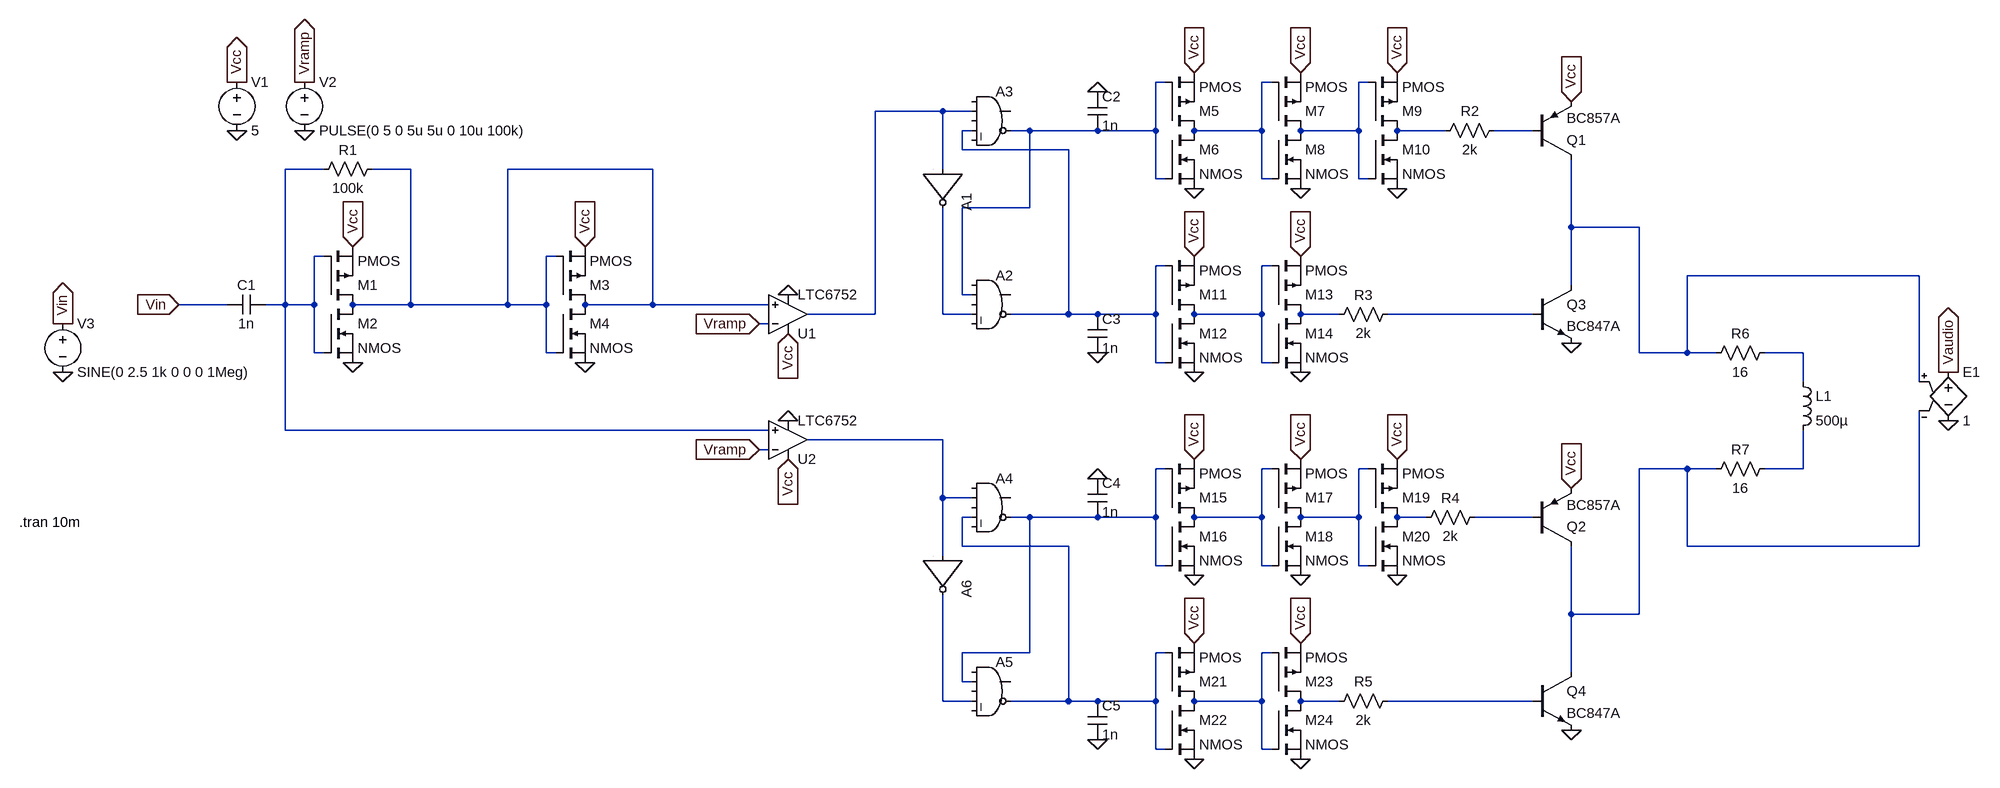
[diagram p0: schematic Week_4&5.asc]
Week_4&5.asc, the LTspice schematic file:
Version 4
SHEET 1 2884 900
WIRE 1488 -256 1472 -256
WIRE 1664 -256 1648 -256
WIRE 1824 -256 1808 -256
WIRE 1120 -208 1008 -208
WIRE 1168 -208 1120 -208
WIRE 1168 -176 1152 -176
WIRE 1264 -176 1232 -176
WIRE 1376 -176 1264 -176
WIRE 1472 -176 1472 -256
WIRE 1472 -176 1376 -176
WIRE 1648 -176 1648 -256
WIRE 1648 -176 1536 -176
WIRE 1808 -176 1808 -256
WIRE 1808 -176 1712 -176
WIRE 1952 -176 1872 -176
WIRE 2096 -176 2032 -176
WIRE 1152 -144 1152 -176
WIRE 1328 -144 1152 -144
WIRE 96 -112 32 -112
WIRE 240 -112 176 -112
WIRE 640 -112 400 -112
WIRE 1120 -112 1120 -208
WIRE 1472 -96 1472 -176
WIRE 1488 -96 1472 -96
WIRE 1648 -96 1648 -176
WIRE 1664 -96 1648 -96
WIRE 1808 -96 1808 -176
WIRE 1824 -96 1808 -96
WIRE 1264 -48 1264 -176
WIRE 1264 -48 1152 -48
WIRE 2160 -16 2160 -128
WIRE 2272 -16 2160 -16
WIRE 96 32 80 32
WIRE 480 32 464 32
WIRE 1488 48 1472 48
WIRE 1664 48 1648 48
WIRE 2736 64 2352 64
WIRE 2160 80 2160 -16
WIRE 1152 96 1152 -48
WIRE 1168 96 1152 96
WIRE -64 112 -144 112
WIRE 32 112 32 -112
WIRE 32 112 0 112
WIRE 80 112 80 32
WIRE 80 112 32 112
WIRE 240 112 240 -112
WIRE 240 112 144 112
WIRE 400 112 400 -112
WIRE 400 112 240 112
WIRE 464 112 464 32
WIRE 464 112 400 112
WIRE 640 112 640 -112
WIRE 640 112 528 112
WIRE 832 112 640 112
WIRE 1008 128 1008 -208
WIRE 1008 128 896 128
WIRE 1120 128 1120 -48
WIRE 1168 128 1120 128
WIRE 1328 128 1328 -144
WIRE 1328 128 1232 128
WIRE 1376 128 1328 128
WIRE 1472 128 1472 48
WIRE 1472 128 1376 128
WIRE 1648 128 1648 48
WIRE 1648 128 1536 128
WIRE 1776 128 1712 128
WIRE 2096 128 1856 128
WIRE 832 144 816 144
WIRE 80 192 80 112
WIRE 96 192 80 192
WIRE 464 192 464 112
WIRE 480 192 464 192
WIRE 2272 192 2272 -16
WIRE 2352 192 2352 64
WIRE 2352 192 2272 192
WIRE 2400 192 2352 192
WIRE 2544 192 2480 192
WIRE 1472 208 1472 128
WIRE 1488 208 1472 208
WIRE 1648 208 1648 128
WIRE 1664 208 1648 208
WIRE 2544 240 2544 192
WIRE 2736 240 2736 64
WIRE 32 320 32 112
WIRE 832 320 32 320
WIRE 1120 336 896 336
WIRE 832 352 816 352
WIRE 1488 384 1472 384
WIRE 1664 384 1648 384
WIRE 1824 384 1808 384
WIRE 2352 384 2272 384
WIRE 2400 384 2352 384
WIRE 2544 384 2544 320
WIRE 2544 384 2480 384
WIRE 1120 432 1120 336
WIRE 1168 432 1120 432
WIRE 1168 464 1152 464
WIRE 1264 464 1232 464
WIRE 1376 464 1264 464
WIRE 1472 464 1472 384
WIRE 1472 464 1376 464
WIRE 1648 464 1648 384
WIRE 1648 464 1536 464
WIRE 1808 464 1808 384
WIRE 1808 464 1712 464
WIRE 1920 464 1872 464
WIRE 2096 464 2000 464
WIRE 1152 512 1152 464
WIRE 1328 512 1152 512
WIRE 2352 512 2352 384
WIRE 2736 512 2736 288
WIRE 2736 512 2352 512
WIRE 1120 528 1120 432
WIRE 1472 544 1472 464
WIRE 1488 544 1472 544
WIRE 1648 544 1648 464
WIRE 1664 544 1648 544
WIRE 1808 544 1808 464
WIRE 1824 544 1808 544
WIRE 2160 624 2160 512
WIRE 2272 624 2272 384
WIRE 2272 624 2160 624
WIRE 1264 688 1264 464
WIRE 1264 688 1152 688
WIRE 1488 688 1472 688
WIRE 1664 688 1648 688
WIRE 2160 720 2160 624
WIRE 1152 736 1152 688
WIRE 1168 736 1152 736
WIRE 1120 768 1120 592
WIRE 1168 768 1120 768
WIRE 1328 768 1328 512
WIRE 1328 768 1232 768
WIRE 1376 768 1328 768
WIRE 1472 768 1472 688
WIRE 1472 768 1376 768
WIRE 1648 768 1648 688
WIRE 1648 768 1536 768
WIRE 1776 768 1712 768
WIRE 2096 768 1856 768
WIRE 1472 848 1472 768
WIRE 1488 848 1472 848
WIRE 1648 848 1648 768
WIRE 1664 848 1648 848
FLAG -48 -176 0
FLAG -48 -256 Vcc
IOPIN -48 -256 Out
FLAG 144 16 Vcc
IOPIN 144 16 In
FLAG 144 208 0
FLAG 528 16 Vcc
IOPIN 528 16 In
FLAG 528 208 0
FLAG -144 112 Vin
IOPIN -144 112 In
FLAG 864 160 Vcc
IOPIN 864 160 In
FLAG 864 368 Vcc
IOPIN 864 368 In
FLAG 864 96 0
FLAG 864 304 0
FLAG 64 -176 0
FLAG 64 -256 Vramp
IOPIN 64 -256 Out
FLAG 816 144 Vramp
IOPIN 816 144 In
FLAG 816 352 Vramp
IOPIN 816 352 In
FLAG -336 224 0
FLAG -336 144 Vin
IOPIN -336 144 Out
FLAG 1376 832 0
FLAG 1376 400 0
FLAG 1376 192 0
FLAG 1376 -240 0
FLAG 1536 -272 Vcc
IOPIN 1536 -272 In
FLAG 1536 -80 0
FLAG 1712 -272 Vcc
IOPIN 1712 -272 In
FLAG 1712 -80 0
FLAG 1872 -272 Vcc
IOPIN 1872 -272 In
FLAG 1872 -80 0
FLAG 1536 32 Vcc
IOPIN 1536 32 In
FLAG 1536 224 0
FLAG 1712 32 Vcc
IOPIN 1712 32 In
FLAG 1712 224 0
FLAG 1536 368 Vcc
IOPIN 1536 368 In
FLAG 1536 560 0
FLAG 1712 368 Vcc
IOPIN 1712 368 In
FLAG 1712 560 0
FLAG 1872 368 Vcc
IOPIN 1872 368 In
FLAG 1872 560 0
FLAG 1536 672 Vcc
IOPIN 1536 672 In
FLAG 1536 864 0
FLAG 1712 672 Vcc
IOPIN 1712 672 In
FLAG 1712 864 0
FLAG 2160 -224 Vcc
IOPIN 2160 -224 In
FLAG 2160 416 Vcc
IOPIN 2160 416 In
FLAG 2160 176 0
FLAG 2160 816 0
FLAG 2784 304 0
FLAG 2784 224 Vaudio
IOPIN 2784 224 Out
SYMBOL pmos 96 112 M180
SYMATTR InstName M1
SYMBOL nmos 96 112 R0
SYMATTR InstName M2
SYMBOL voltage -48 -272 R0
WINDOW 123 0 0 Left 2
WINDOW 39 0 0 Left 2
SYMATTR InstName V1
SYMATTR Value 5
SYMBOL res 80 -96 R270
WINDOW 0 32 56 VTop 2
WINDOW 3 0 56 VBottom 2
SYMATTR InstName R1
SYMATTR Value 100k
SYMBOL pmos 480 112 M180
SYMATTR InstName M3
SYMBOL nmos 480 112 R0
SYMATTR InstName M4
SYMBOL cap 0 96 R90
WINDOW 0 0 32 VBottom 2
WINDOW 3 32 32 VTop 2
SYMATTR InstName C1
SYMATTR Value 1n
SYMBOL Comparators\\LTC6752 864 192 M180
SYMATTR InstName U1
SYMBOL Comparators\\LTC6752 864 400 M180
SYMATTR InstName U2
SYMBOL voltage 64 -272 R0
WINDOW 123 0 0 Left 2
WINDOW 39 0 0 Left 2
SYMATTR InstName V2
SYMATTR Value PULSE(0 5 0 5u 5u 0 10u 100k)
SYMBOL voltage -336 128 R0
WINDOW 123 0 0 Left 2
WINDOW 39 0 0 Left 2
SYMATTR InstName V3
SYMATTR Value SINE(0 2.5 1k 0 0 0 1Meg)
SYMBOL Digital\\and 1200 48 R0
WINDOW 3 16 112 Invisible 2
SYMATTR Value Vhigh = 5
SYMATTR InstName A2
SYMBOL Digital\\and 1200 -256 R0
WINDOW 3 16 112 Invisible 2
SYMATTR Value Vhigh = 5
SYMATTR InstName A3
SYMBOL Digital\\and 1200 384 R0
WINDOW 3 16 112 Invisible 2
SYMATTR Value Vhigh = 5
SYMATTR InstName A4
SYMBOL Digital\\and 1200 688 R0
WINDOW 3 16 112 Invisible 2
SYMATTR Value Vhigh = 5
SYMATTR InstName A5
SYMBOL Digital\\inv 1184 -112 R90
SYMATTR InstName A1
SYMBOL Digital\\inv 1184 528 R90
SYMATTR InstName A6
SYMBOL cap 1360 -240 R0
SYMATTR InstName C2
SYMATTR Value 1n
SYMBOL cap 1360 128 R0
SYMATTR InstName C3
SYMATTR Value 1n
SYMBOL cap 1360 400 R0
SYMATTR InstName C4
SYMATTR Value 1n
SYMBOL cap 1360 768 R0
SYMATTR InstName C5
SYMATTR Value 1n
SYMBOL pmos 1488 -176 M180
SYMATTR InstName M5
SYMBOL nmos 1488 -176 R0
SYMATTR InstName M6
SYMBOL pmos 1664 -176 M180
SYMATTR InstName M7
SYMBOL nmos 1664 -176 R0
SYMATTR InstName M8
SYMBOL pmos 1824 -176 M180
SYMATTR InstName M9
SYMBOL nmos 1824 -176 R0
SYMATTR InstName M10
SYMBOL pmos 1488 128 M180
SYMATTR InstName M11
SYMBOL nmos 1488 128 R0
SYMATTR InstName M12
SYMBOL pmos 1664 128 M180
SYMATTR InstName M13
SYMBOL nmos 1664 128 R0
SYMATTR InstName M14
SYMBOL pmos 1488 464 M180
SYMATTR InstName M15
SYMBOL nmos 1488 464 R0
SYMATTR InstName M16
SYMBOL pmos 1664 464 M180
SYMATTR InstName M17
SYMBOL nmos 1664 464 R0
SYMATTR InstName M18
SYMBOL pmos 1824 464 M180
SYMATTR InstName M19
SYMBOL nmos 1824 464 R0
SYMATTR InstName M20
SYMBOL pmos 1488 768 M180
SYMATTR InstName M21
SYMBOL nmos 1488 768 R0
SYMATTR InstName M22
SYMBOL pmos 1664 768 M180
SYMATTR InstName M23
SYMBOL nmos 1664 768 R0
SYMATTR InstName M24
SYMBOL res 1936 -160 R270
WINDOW 0 32 56 VTop 2
WINDOW 3 0 56 VBottom 2
SYMATTR InstName R2
SYMATTR Value 2k
SYMBOL res 1760 144 R270
WINDOW 0 32 56 VTop 2
WINDOW 3 0 56 VBottom 2
SYMATTR InstName R3
SYMATTR Value 2k
SYMBOL res 1904 480 R270
WINDOW 0 32 56 VTop 2
WINDOW 3 0 56 VBottom 2
SYMATTR InstName R4
SYMATTR Value 2k
SYMBOL res 1760 784 R270
WINDOW 0 32 56 VTop 2
WINDOW 3 0 56 VBottom 2
SYMATTR InstName R5
SYMATTR Value 2k
SYMBOL pnp 2096 -128 M180
SYMATTR InstName Q1
SYMATTR Value BC857A
SYMBOL pnp 2096 512 M180
SYMATTR InstName Q2
SYMATTR Value BC857A
SYMBOL npn 2096 80 R0
SYMATTR InstName Q3
SYMATTR Value BC847A
SYMBOL npn 2096 720 R0
SYMATTR InstName Q4
SYMATTR Value BC847A
SYMBOL res 2384 208 R270
WINDOW 0 32 56 VTop 2
WINDOW 3 0 56 VBottom 2
SYMATTR InstName R6
SYMATTR Value 16
SYMBOL res 2384 400 R270
WINDOW 0 32 56 VTop 2
WINDOW 3 0 56 VBottom 2
SYMATTR InstName R7
SYMATTR Value 16
SYMBOL ind 2528 224 R0
SYMATTR InstName L1
SYMATTR Value 500µ
SYMBOL e 2784 208 R0
SYMATTR InstName E1
SYMATTR Value 1
TEXT -408 472 Left 2 !.tran 10m

The netlist it stands for:
* Week_4&5.asc
M1 N009 N008 Vcc Vcc PMOS
M2 N009 N008 0 0 NMOS
V1 Vcc 0 5
R1 N008 N009 100k
M3 N009 N009 Vcc Vcc PMOS
M4 N009 N009 0 0 NMOS
C1 N008 Vin 1n
XU1 N009 Vramp Vcc 0 N004 LTC6752  ; pins In+ In- V+ V- OUT
XU2 N008 Vramp Vcc 0 N016 LTC6752  ; pins In+ In- V+ V- OUT
V2 Vramp 0 PULSE(0 5 0 5u 5u 0 10u 100k)
V3 Vin 0 SINE(0 2.5 1k 0 0 0 1Meg)
A2 0 N001 0 N012 0 N005 0 0 AND Vhigh = 5
A3 0 N004 0 N005 0 N001 0 0 AND Vhigh = 5
A4 0 N016 0 N022 0 N017 0 0 AND Vhigh = 5
A5 0 N017 0 N026 0 N022 0 0 AND Vhigh = 5
A1 N004 0 0 0 0 N012 0 0 BUF
A6 N016 0 0 0 0 N026 0 0 BUF
C2 0 N001 1n
C3 N005 0 1n
C4 0 N017 1n
C5 N022 0 1n
M5 N002 N001 Vcc Vcc PMOS
M6 N002 N001 0 0 NMOS
M7 N003 N002 Vcc Vcc PMOS
M8 N003 N002 0 0 NMOS
M9 N006 N003 Vcc Vcc PMOS
M10 N006 N003 0 0 NMOS
M11 N011 N005 Vcc Vcc PMOS
M12 N011 N005 0 0 NMOS
M13 N013 N011 Vcc Vcc PMOS
M14 N013 N011 0 0 NMOS
M15 N018 N017 Vcc Vcc PMOS
M16 N018 N017 0 0 NMOS
M17 N019 N018 Vcc Vcc PMOS
M18 N019 N018 0 0 NMOS
M19 N023 N019 Vcc Vcc PMOS
M20 N023 N019 0 0 NMOS
M21 N025 N022 Vcc Vcc PMOS
M22 N025 N022 0 0 NMOS
M23 N027 N025 Vcc Vcc PMOS
M24 N027 N025 0 0 NMOS
R2 N006 N007 2k
R3 N013 N014 2k
R4 N023 N024 2k
R5 N027 N028 2k
Q1 N010 N007 Vcc 0 BC857A
Q2 N020 N024 Vcc 0 BC857A
Q3 N010 N014 0 0 BC847A
Q4 N020 N028 0 0 BC847A
R6 N010 N015 16
R7 N020 N021 16
L1 N015 N021 500µ
E1 Vaudio 0 N010 N020 1
.model NPN NPN
.model PNP PNP
.lib standard.bjt
.model NMOS NMOS
.model PMOS PMOS
.lib standard.mos
.tran 10m
.lib LTC7.lib
.backanno
.end